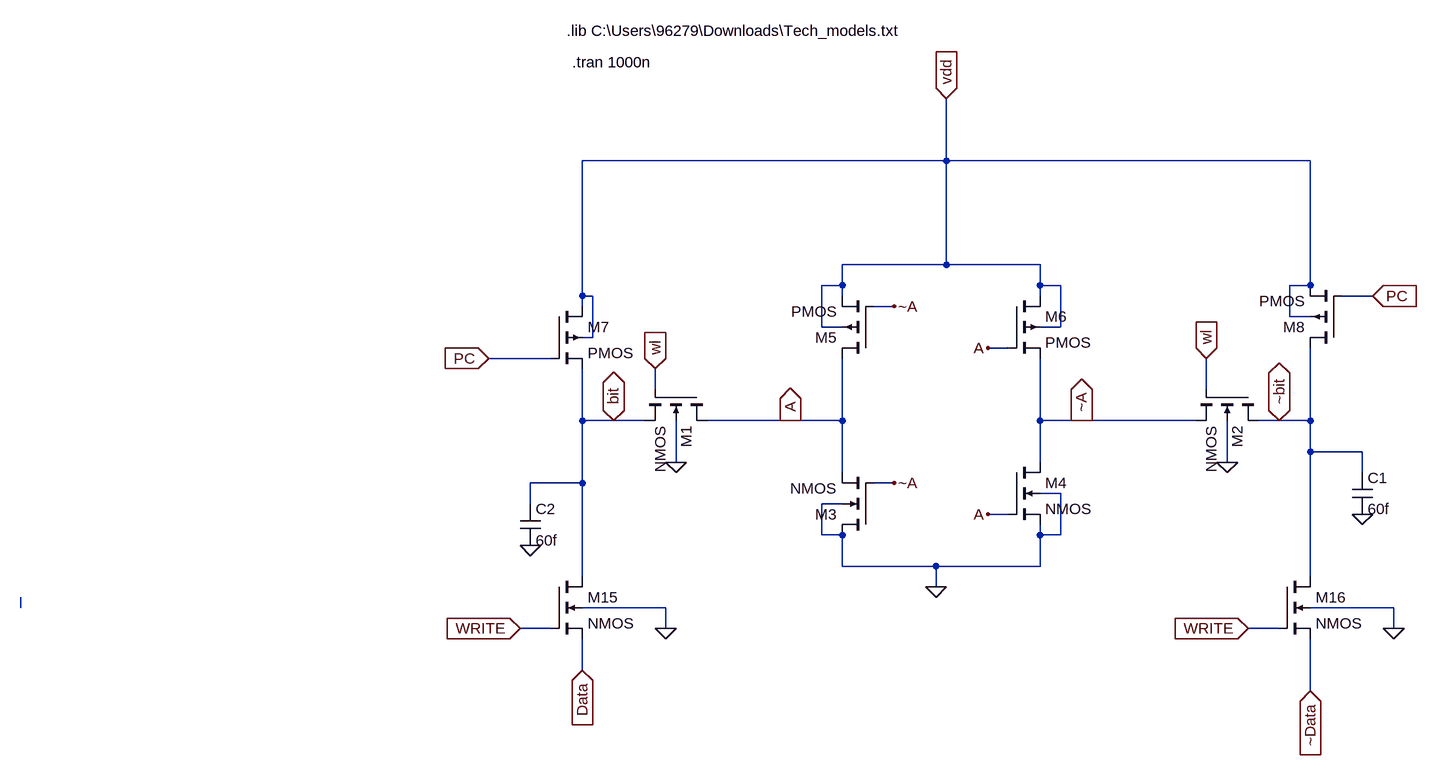
[diagram p0: schematic SRAM_cell.asc]
SRAM_cell.asc, the LTspice schematic file:
Version 4
SHEET 1 3236 1572
WIRE 1520 112 1520 16
WIRE 1520 112 960 112
WIRE 2080 112 1520 112
WIRE 1520 272 1520 112
WIRE 1520 272 1360 272
WIRE 1664 272 1520 272
WIRE 1360 304 1360 272
WIRE 1360 304 1328 304
WIRE 1664 304 1664 272
WIRE 1696 304 1664 304
WIRE 2080 304 2080 112
WIRE 2080 304 2048 304
WIRE 960 320 960 112
WIRE 976 320 960 320
WIRE 1360 320 1360 304
WIRE 1664 320 1664 304
WIRE 2176 320 2128 320
WIRE 960 336 960 320
WIRE 1440 336 1408 336
WIRE 2048 352 2048 304
WIRE 2080 352 2048 352
WIRE 1328 368 1328 304
WIRE 1360 368 1328 368
WIRE 1696 368 1696 304
WIRE 1696 368 1664 368
WIRE 976 384 976 320
WIRE 976 384 960 384
WIRE 1616 400 1584 400
WIRE 912 416 816 416
WIRE 1072 464 1072 432
WIRE 1920 464 1920 416
WIRE 960 512 960 432
WIRE 1008 512 960 512
WIRE 1056 512 1008 512
WIRE 1280 512 1152 512
WIRE 1360 512 1360 416
WIRE 1360 512 1280 512
WIRE 1664 512 1664 416
WIRE 1728 512 1664 512
WIRE 1904 512 1728 512
WIRE 2032 512 2000 512
WIRE 2080 512 2080 400
WIRE 2080 512 2032 512
WIRE 2080 560 2080 512
WIRE 2160 560 2080 560
WIRE 1104 576 1104 512
WIRE 1664 576 1664 512
WIRE 1952 576 1952 512
WIRE 1360 592 1360 512
WIRE 2160 592 2160 560
WIRE 960 608 960 512
WIRE 960 608 880 608
WIRE 1440 608 1408 608
WIRE 1696 624 1664 624
WIRE 880 640 880 608
WIRE 1360 640 1328 640
WIRE 1616 656 1584 656
WIRE 1328 688 1328 640
WIRE 1360 688 1328 688
WIRE 1664 688 1664 672
WIRE 1696 688 1696 624
WIRE 1696 688 1664 688
WIRE 1360 736 1360 688
WIRE 1504 736 1360 736
WIRE 1664 736 1664 688
WIRE 1664 736 1504 736
WIRE 960 752 960 608
WIRE 2080 752 2080 560
WIRE 1504 768 1504 736
WIRE 96 800 96 784
WIRE 1088 800 960 800
WIRE 2208 800 2080 800
WIRE 912 832 864 832
WIRE 1088 832 1088 800
WIRE 2032 832 1984 832
WIRE 2208 832 2208 800
WIRE 960 896 960 848
WIRE 2080 928 2080 848
FLAG 1728 512 ~A
IOPIN 1728 512 Out
FLAG 1280 512 A
IOPIN 1280 512 Out
FLAG 1584 400 A
FLAG 1584 656 A
FLAG 1440 608 ~A
FLAG 1440 336 ~A
FLAG 1072 432 wl
IOPIN 1072 432 In
FLAG 1920 416 wl
IOPIN 1920 416 In
FLAG 816 416 PC
IOPIN 816 416 In
FLAG 1008 512 bit
IOPIN 1008 512 BiDir
FLAG 1952 576 0
FLAG 2176 320 PC
IOPIN 2176 320 In
FLAG 1104 576 0
FLAG 2032 512 ~bit
IOPIN 2032 512 BiDir
FLAG 864 832 WRITE
IOPIN 864 832 In
FLAG 960 896 Data
IOPIN 960 896 In
FLAG 1088 832 0
FLAG 1984 832 WRITE
IOPIN 1984 832 In
FLAG 2080 928 ~Data
IOPIN 2080 928 In
FLAG 2208 832 0
FLAG 880 704 0
FLAG 2160 656 0
FLAG 1504 768 0
FLAG 1520 16 vdd
IOPIN 1520 16 In
SYMBOL nmos4 1152 464 R90
SYMATTR InstName M1
SYMATTR Value2 l=250n w=100n
SYMBOL nmos4 2000 464 R90
SYMATTR InstName M2
SYMATTR Value2 l=250n w=100n
SYMBOL nmos4 1408 688 R180
SYMATTR InstName M3
SYMATTR Value2 l=32n w=64n
SYMBOL nmos4 1616 576 R0
SYMATTR InstName M4
SYMATTR Value2 l=32n w=64n
SYMBOL pmos4 1408 416 R180
SYMATTR InstName M5
SYMATTR Value2 l=250n w=600n
SYMBOL pmos4 1616 320 R0
SYMATTR InstName M6
SYMATTR Value2 l=250n w=600n
SYMBOL pmos4 912 336 R0
SYMATTR InstName M7
SYMATTR Value2 l=32n w=1280n
SYMBOL pmos4 2128 400 R180
SYMATTR InstName M8
SYMATTR Value2 l=32n w=1280n
SYMBOL nmos4 912 752 R0
SYMATTR InstName M15
SYMATTR Value2 l=32n w=1000n
SYMBOL nmos4 2032 752 R0
SYMATTR InstName M16
SYMATTR Value2 l=32n w=1000n
SYMBOL cap 2144 592 R0
SYMATTR InstName C1
SYMATTR Value 60f
SYMBOL cap 864 640 R0
SYMATTR InstName C2
SYMATTR Value 60f
TEXT 936 -88 Left 2 !.lib C:\\Users\\96279\\Downloads\\Tech_models.txt
TEXT 944 -40 Left 2 !.tran 1000n

The netlist it stands for:
* SRAM_cell.asc
M1 A wl bit 0 NMOS l=250n w=100n
M2 ~bit wl ~A 0 NMOS l=250n w=100n
M3 0 ~A A 0 NMOS l=32n w=64n
M4 ~A A 0 0 NMOS l=32n w=64n
M5 A ~A vdd vdd PMOS l=250n w=600n
M6 vdd A ~A vdd PMOS l=250n w=600n
M7 vdd PC bit vdd PMOS l=32n w=1280n
M8 ~bit PC vdd vdd PMOS l=32n w=1280n
M15 bit WRITE Data 0 NMOS l=32n w=1000n
M16 ~bit WRITE ~Data 0 NMOS l=32n w=1000n
C1 ~bit 0 60f
C2 bit 0 60f
.model NMOS NMOS
.model PMOS PMOS
.lib standard.mos
.lib C:\Users\96279\Downloads\Tech_models.txt
.tran 1000n
.backanno
.end